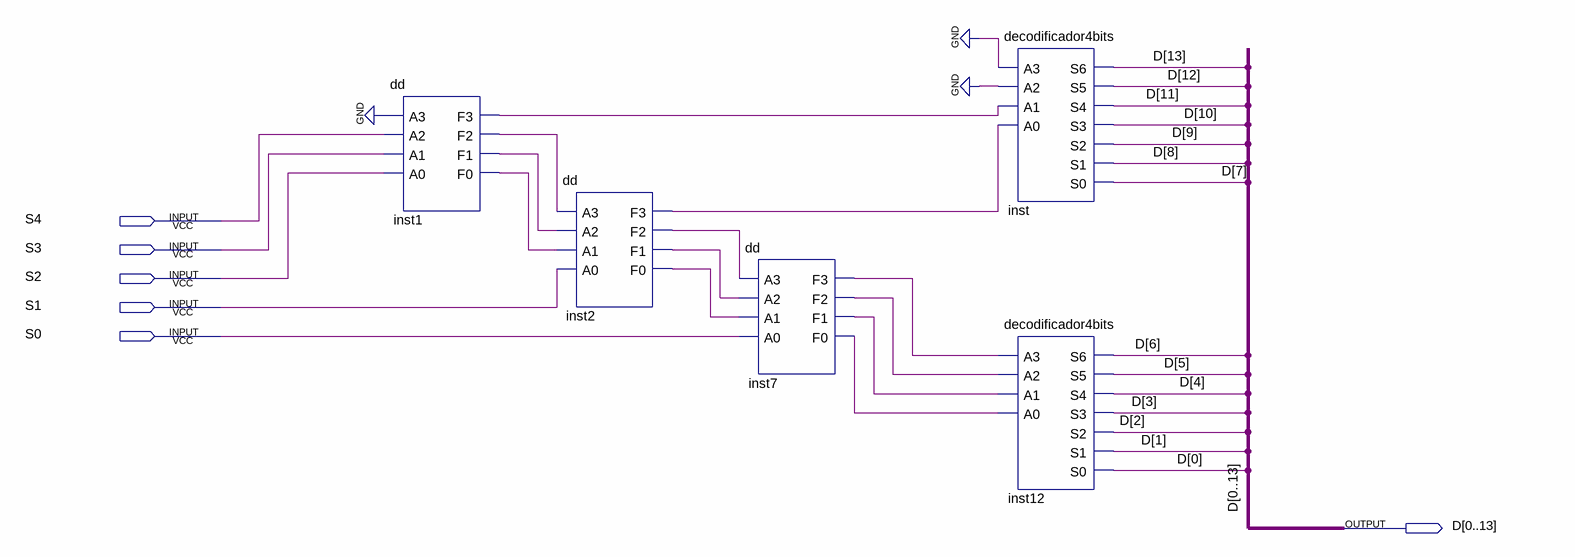
[diagram p0: schematic sheet]
// Quartus schematic decodificar_S.bdf as structural Verilog: 5 symbols, 6 pins
module decodificar_S (
  input  S4,
  input  S3,
  input  S2,
  input  S1,
  input  S0,
  output [0:13] D
);

  wire inst1_f0, inst1_f1, inst1_f2, inst1_f3, inst2_f0, inst2_f1, inst2_f2, inst2_f3, inst7_f0, inst7_f1,
       inst7_f2, inst7_f3;

  dd inst1 (.A3(1'b0), .A2(S4), .A1(S3), .A0(S2), .F3(inst1_f3), .F2(inst1_f2), .F1(inst1_f1), .F0(inst1_f0));
  dd inst2 (
    .A3(inst1_f2), .A2(inst1_f1), .A1(inst1_f0), .A0(S1), .F3(inst2_f3), .F2(inst2_f2), .F1(inst2_f1),
    .F0(inst2_f0));
  dd inst7 (
    .A3(inst2_f2), .A2(inst2_f1), .A1(inst2_f0), .A0(S0), .F3(inst7_f3), .F2(inst7_f2), .F1(inst7_f1),
    .F0(inst7_f0));
  decodificador4bits inst (
    .A3(1'b0), .A2(1'b0), .A1(inst1_f3), .A0(inst2_f3), .S6(D[13]), .S5(D[12]), .S4(D[11]), .S3(D[10]),
    .S2(D[9]), .S1(D[8]), .S0(D[7]));
  decodificador4bits inst12 (
    .A3(inst7_f3), .A2(inst7_f2), .A1(inst7_f1), .A0(inst7_f0), .S6(D[6]), .S5(D[5]), .S4(D[4]), .S3(D[3]),
    .S2(D[2]), .S1(D[1]), .S0(D[0]));
endmodule
